# EAGLE design z80_small (EAGLE 6.5.0)
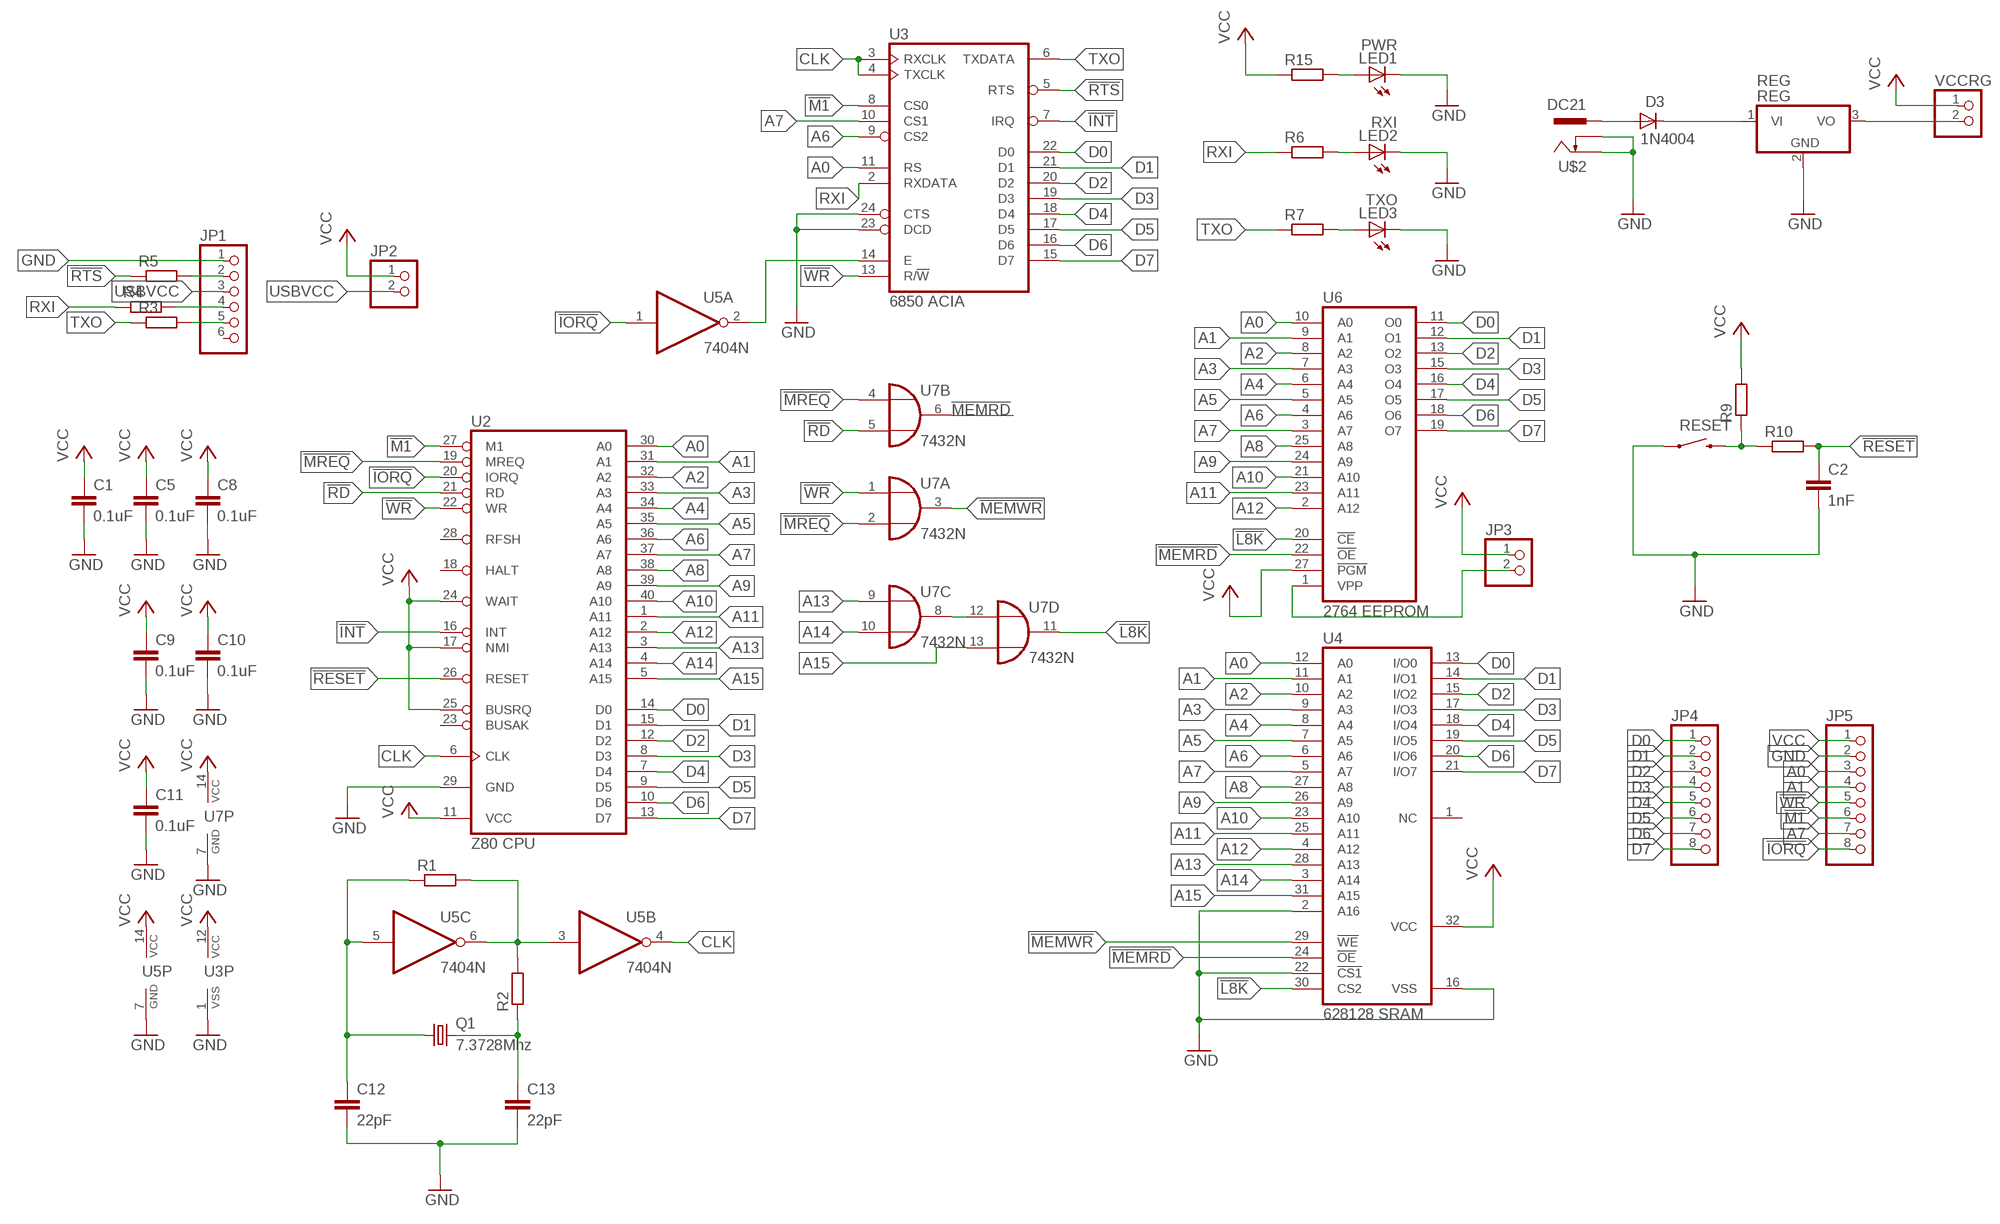
[diagram p0: schematic, sheet 1]

## Parts
C1  0.1uF  C-EU025-025X050  [C025-025X050]
C2  1nF  C-EU025-025X050  [C025-025X050]
C5  0.1uF  C-EU025-025X050  [C025-025X050]
C8  0.1uF  C-EU025-025X050  [C025-025X050]
C9  0.1uF  C-EU025-025X050  [C025-025X050]
C10  0.1uF  C-EU025-025X050  [C025-025X050]
C11  0.1uF  C-EU025-025X050  [C025-025X050]
C12  22pF  C-EU025-025X050  [C025-025X050]
C13  22pF  C-EU025-025X050  [C025-025X050]
D3  1N4004  [DO41-10]
JP1  PINHD-1X6  [1X06]
JP2  PINHD-1X2  [1X02]
JP3  PINHD-1X2  [1X02]
JP4  PINHD-1X8  [1X08]
JP5  PINHD-1X8  [1X08]
LED1  PWR  LED3MM  [LED3MM]
LED2  RXI  LED3MM  [LED3MM]
LED3  TXO  LED3MM  [LED3MM]
Q1  7.3728Mhz  CRYSTALHC49S  [HC49/S]
R1  1M  R-EU_0204/7  [0204/7]
R2  1K  R-EU_0204/7  [0204/7]
R3  2K2  R-EU_0204/7  [0204/7]
R4  2K2  R-EU_0204/7  [0204/7]
R5  2K2  R-EU_0204/7  [0204/7]
R6  470  R-EU_0204/7  [0204/7]
R7  470  R-EU_0204/7  [0204/7]
R9  10K  R-EU_0204/7  [0204/7]
R10  330  R-EU_0204/7  [0204/7]
R15  470  R-EU_0204/7  [0204/7]
REG  REG  786TV  [TO220V]
RESET  SWITCH-MOMENTARY-2SIDE_EZ  [TACTILE-PTH-SIDEEZ]
U2  Z80 CPU  Z80CPU  [DIL40]
U3  6850 ACIA  6850  [DIL24]
U4  628128 SRAM  628128P  [DIL32]
U5  7404N  [DIL14]
U6  2764 EEPROM  2764  [DIL28]
U7  7432N  [DIL14]
U$2  DC21  [DCSKT]
VCCRG  PINHD-1X2  [1X02]

## Nets
!INT: U2.16(INT) U3.7(IRQ)
!IORQ: JP5.8 U2.20(IORQ) U5.1(A:I)
!L8K: U4.30(CS2) U6.20(!CE) U7.11(D:O)
!M1: JP5.6 U2.27(M1) U3.8(CS0)
!MEMRD: U4.24(!OE) U6.22(!OE) U7.6(B:O)
!MEMWR: U4.29(!WE) U7.3(A:O)
!MREQ: U2.19(MREQ) U7.2(A:I1) U7.4(B:I0)
!PRTS: JP1.2 R5.2
!RD: U2.21(RD) U7.5(B:I1)
!RESET: C2.1 R10.2 U2.26(RESET)
!RTS: R5.1 U3.5(RTS)
!WR: JP5.5 U2.22(WR) U3.13(R/!W) U7.1(A:I0)
+VRAW [VCC]: D3.C REG.1(VI)
A0: JP5.3 U2.30(A0) U3.11(RS) U4.12(A0) U6.10(A0)
A1: JP5.4 U2.31(A1) U4.11(A1) U6.9(A1)
A2: U2.32(A2) U4.10(A2) U6.8(A2)
A3: U2.33(A3) U4.9(A3) U6.7(A3)
A4: U2.34(A4) U4.8(A4) U6.6(A4)
A5: U2.35(A5) U4.7(A5) U6.5(A5)
A6: U2.36(A6) U3.9(CS2) U4.6(A6) U6.4(A6)
A7: JP5.7 U2.37(A7) U3.10(CS1) U4.5(A7) U6.3(A7)
A8: U2.38(A8) U4.27(A8) U6.25(A8)
A9: U2.39(A9) U4.26(A9) U6.24(A9)
A10: U2.40(A10) U4.23(A10) U6.21(A10)
A11: U2.1(A11) U4.25(A11) U6.23(A11)
A12: U2.2(A12) U4.4(A12) U6.2(A12)
A13: U2.3(A13) U4.28(A13) U7.9(C:I0)
A14: U2.4(A14) U4.3(A14) U7.10(C:I1)
A15: U2.5(A15) U4.31(A15) U7.13(D:I1)
CLK: U2.6(CLK) U3.3(RXCLK) U3.4(TXCLK) U5.4(B:O)
D0: JP4.1 U2.14(D0) U3.22(D0) U4.13(I/O0) U6.11(O0)
D1: JP4.2 U2.15(D1) U3.21(D1) U4.14(I/O1) U6.12(O1)
D2: JP4.3 U2.12(D2) U3.20(D2) U4.15(I/O2) U6.13(O2)
D3: JP4.4 U2.8(D3) U3.19(D3) U4.17(I/O3) U6.15(O3)
D4: JP4.5 U2.7(D4) U3.18(D4) U4.18(I/O4) U6.16(O4)
D5: JP4.6 U2.9(D5) U3.17(D5) U4.19(I/O5) U6.17(O5)
D6: JP4.7 U2.10(D6) U3.16(D6) U4.20(I/O6) U6.18(O6)
D7: JP4.8 U2.13(D7) U3.15(D7) U4.21(I/O7) U6.19(O7)
GND [GND]: C1.2 C2.2 C5.2 C8.2 C9.2 C10.2 C11.2 C12.2 C13.2 JP1.1 JP5.2 LED1.K(C) LED2.K(C) LED3.K(C) RESET.1 U2.29(GND) U3.1(VSS) U3.23(DCD) U3.24(CTS) U4.2(A16) U4.16(VSS) U4.22(!CS1) U5.7(P:GND) U7.7(P:GND) U$2.2 U$2.3
N$1: R1.2 R2.2 U5.3(B:I) U5.6(C:O)
N$2: U3.14(E) U5.2(A:O)
N$3: C12.1 Q1.1 R1.1 U5.5(C:I)
N$4: U7.8(C:O) U7.12(D:I0)
N$5: C13.1 Q1.2 R2.1
N$6: REG.3(VO) VCCRG.2
N$7: LED2.A R6.2
N$8: LED3.A R7.2
N$12 [VCC]: D3.A U$2.1
N$14: R9.1 R10.1 RESET.2
N$17: LED1.A R15.2
PRXI: JP1.4 R4.2
PTXO: JP1.5 R3.2
RXI: R4.1 R6.1 U3.2(RXDATA)
TXO: R3.1 R7.1 U3.6(TXDATA)
USBVCC [VCC]: JP1.3 JP2.2
VCC [VCC]: C1.1 C5.1 C8.1 C9.1 C10.1 C11.1 JP2.1 JP3.1 JP5.1 R9.2 R15.1 U2.11(VCC) U2.17(NMI) U2.24(WAIT) U2.25(BUSRQ) U3.12(VCC) U4.32(VCC) U5.14(P:VCC) U6.27(!PGM) U7.14(P:VCC) VCCRG.1
VPP [VCC]: JP3.2 U6.1(VPP)
Unconnected: JP1.6 REG.2(GND) U2.18(HALT) U2.23(BUSAK) U2.28(RFSH) U4.1(NC) U5.8(D:O) U5.9(D:I) U5.10(E:O) U5.11(E:I) U5.12(F:O) U5.13(F:I)

## Power pins joined to a net without a drawn wire
GND: U6.14(GND)
VCC: U6.28(VCC)

## Library data of the parts
C1 C2 C5 C8-C13 = rcl:C-EU: CAPACITOR, European symbol
D3 = diode:1N4004: DIODE general purpose rectifier, 1 A
JP1 = pinhead:PINHD-1X6: PIN HEADER
JP2 JP3 VCCRG = pinhead:PINHD-1X2: PIN HEADER
JP4 JP5 = pinhead:PINHD-1X8: PIN HEADER
LED1-LED3 = led:LED: LED OSRAM: - CHIPLED LG R971, LG N971, LY N971, LG Q971, LY Q971, LO R971, LY R971 LH N974, LH R974 LS Q976, LO Q976, LY Q976 LO Q996 - Hyper CHIPLED LW Q18S LB Q993, LB Q99A, LB R99A - SideLED LS A670, LO A670, LY A670, LG A670, LP A670 LB A673, LV A673, LT A673, LW A673 LH A674 LY A675 LS A676, LA A676, LO A676, LY A676, LW A676 LS A679, LY A679, LG A679 - Hyper Micro SIDELED® LS Y876, LA Y876, LO Y876, LY Y876 LT Y87S - SmartLED LW L88C, LW L88S LB L89C, LB L89S, LG L890 LS L89K, LO L89K, LY L89K LS L896, LA L896, LO L896, LY L896 - TOPLED LS T670, LO T670, LY T670, LG T670, LP T670 LSG T670, LSP T670, LSY T670, LOP T670, LYG T670 LG T671, LOG T671, LSG T671 LB T673, LV T673, LT T673, LW T673 LH T674 LS T676, LA T676, LO T676, LY T676, LB T676, LH T676, LSB T676, LW T676 LB T67C, LV T67C, LT T67C, LS T67K, LO T67K, LY T67K, LW E67C LS E67B, LA E67B, LO E67B, LY E67B, LB E67C, LV E67C, LT E67C LW T67C LS T679, LY T679, LG T679 LS T770, LO T770, LY T770, LG T770, LP T770 LB T773, LV T773, LT T773, LW T773 LH T774 LS E675, LA E675, LY E675, LS T675 LS T776, LA T776, LO T776, LY T776, LB T776 LHGB T686 LT T68C, LB T68C - Hyper Mini TOPLED® LB M676 - Mini TOPLED Santana® LG M470 LS M47K, LO M47K, LY M47K Source: http://www.osram.convergy.de LUXEON: - LUMILED® LXK2-PW12-R00, LXK2-PW12-S00, LXK2-PW14-U00, LXK2-PW14-V00 LXK2-PM12-R00, LXK2-PM12-S00, LXK2-PM14-U00 LXK2-PE12-Q00, LXK2-PE12-R00, LXK2-PE12-S00, LXK2-PE14-T00, LXK2-PE14-U00 LXK2-PB12-K00, LXK2-PB12-L00, LXK2-PB12-M00, LXK2-PB14-N00, LXK2-PB14-P00, LXK2-PB14-Q00 LXK2-PR12-L00, LXK2-PR12-M00, LXK2-PR14-Q00, LXK2-PR14-R00 LXK2-PD12-Q00, LXK2-PD12-R00, LXK2-PD12-S00 LXK2-PH12-R00, LXK2-PH12-S00 LXK2-PL12-P00, LXK2-PL12-Q00, LXK2-PL12-R00 Source: www.luxeon.com KINGBRIGHT: KA-3528ASYC Source: www.kingbright.com
Q1 = crystal:CRYSTAL: CRYSTAL; OC_FARNELL: 1667008; OC_NEWARK: unknown
R1-R7 R9 R10 R15 = rcl:R-EU_: RESISTOR, European symbol
REG = linear:78*: Positive VOLTAGE REGULATOR Source: http://cache.national.com/ds/LM/LM78L05.pdf http://www.fairchildsemi.com/ds/LM/LM7805.pdf
RESET = SparkFun-Electromechanical:SWITCH-MOMENTARY-2: Various NO switches- pushbuttons, reed, etc
U2 = zilog:Z80CPU: Z80 FAMILY DEVICE
U3 = micro-motorola:6850: MICROCONTROLLER/MEMORY DEVICE; MF: NTE ELECTRONICS; MPN: NTE6850; OC_FARNELL: 4899775; OC_NEWARK: 31C2457
U4 = memory-hitachi:628128P: MEMORY; OC_FARNELL: unknown; OC_NEWARK: unknown
U5 = 74xx-eu:74*04: Hex INVERTER
U6 = memory:2764: MEMORY
U7 = 74xx-eu:74*32: Quad 2-input OR gate
U$2 = dcsocket:DC21: DC 2.1 mm Power Socket Negative Centre

## Net classes
0 default: width 0.254 mm, drill 0.508 mm
1 VCC: width 0.66 mm, drill 0.508 mm
2 GND: width 0.66 mm, drill 0.508 mm

## Board
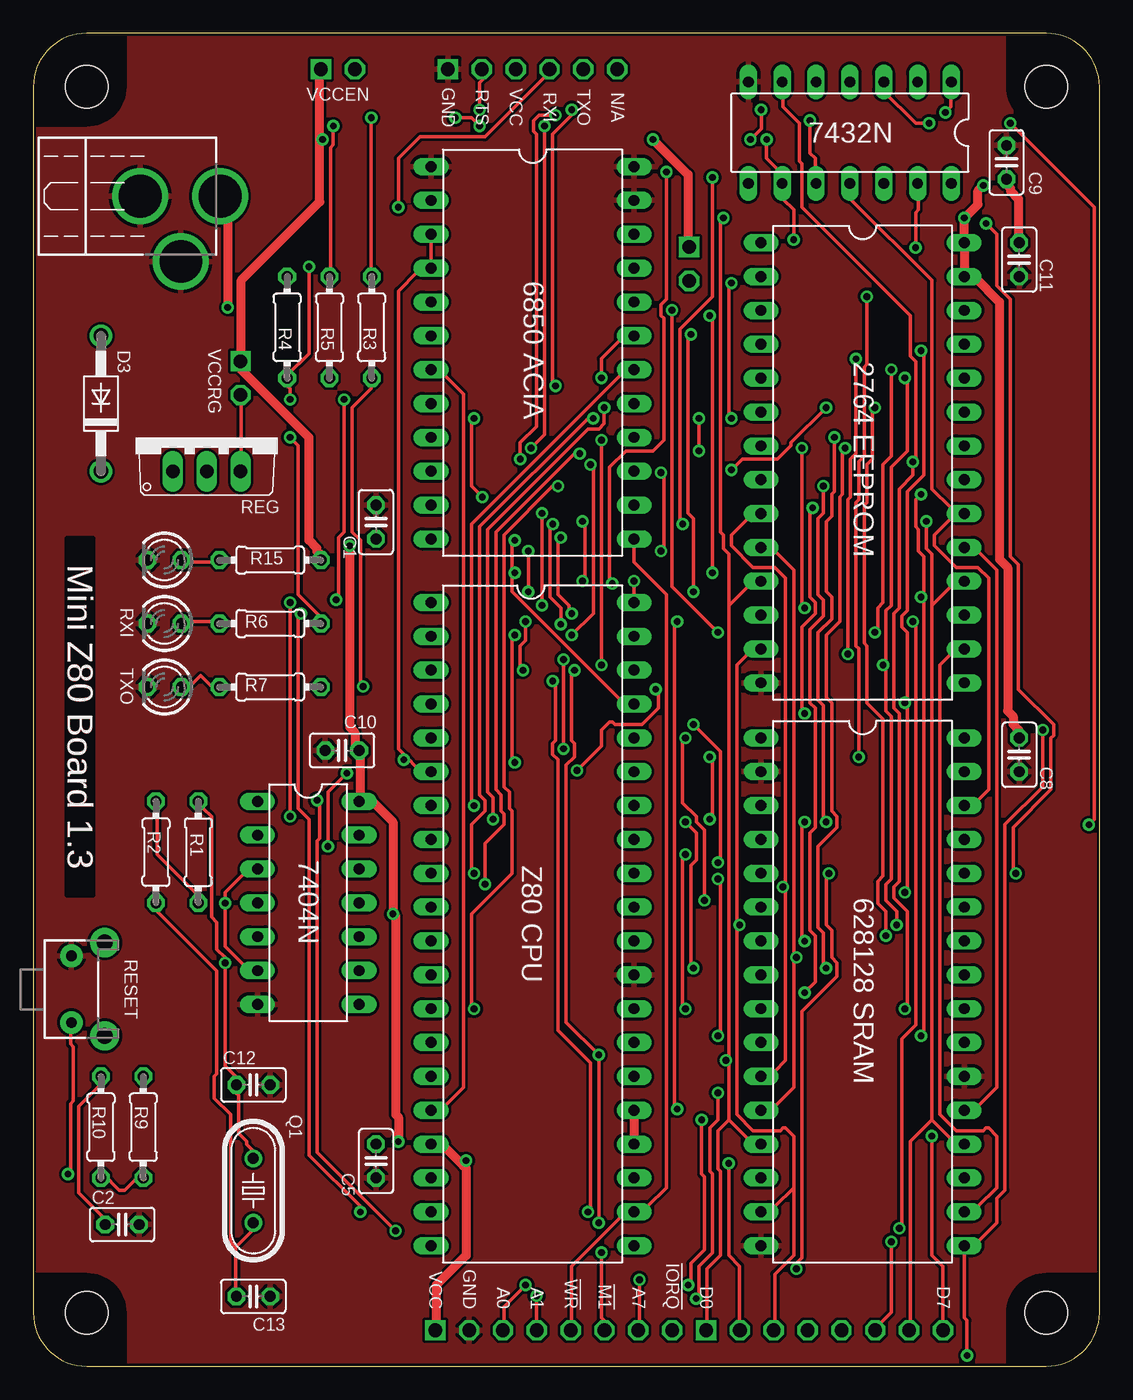
[diagram p1: board, top side]
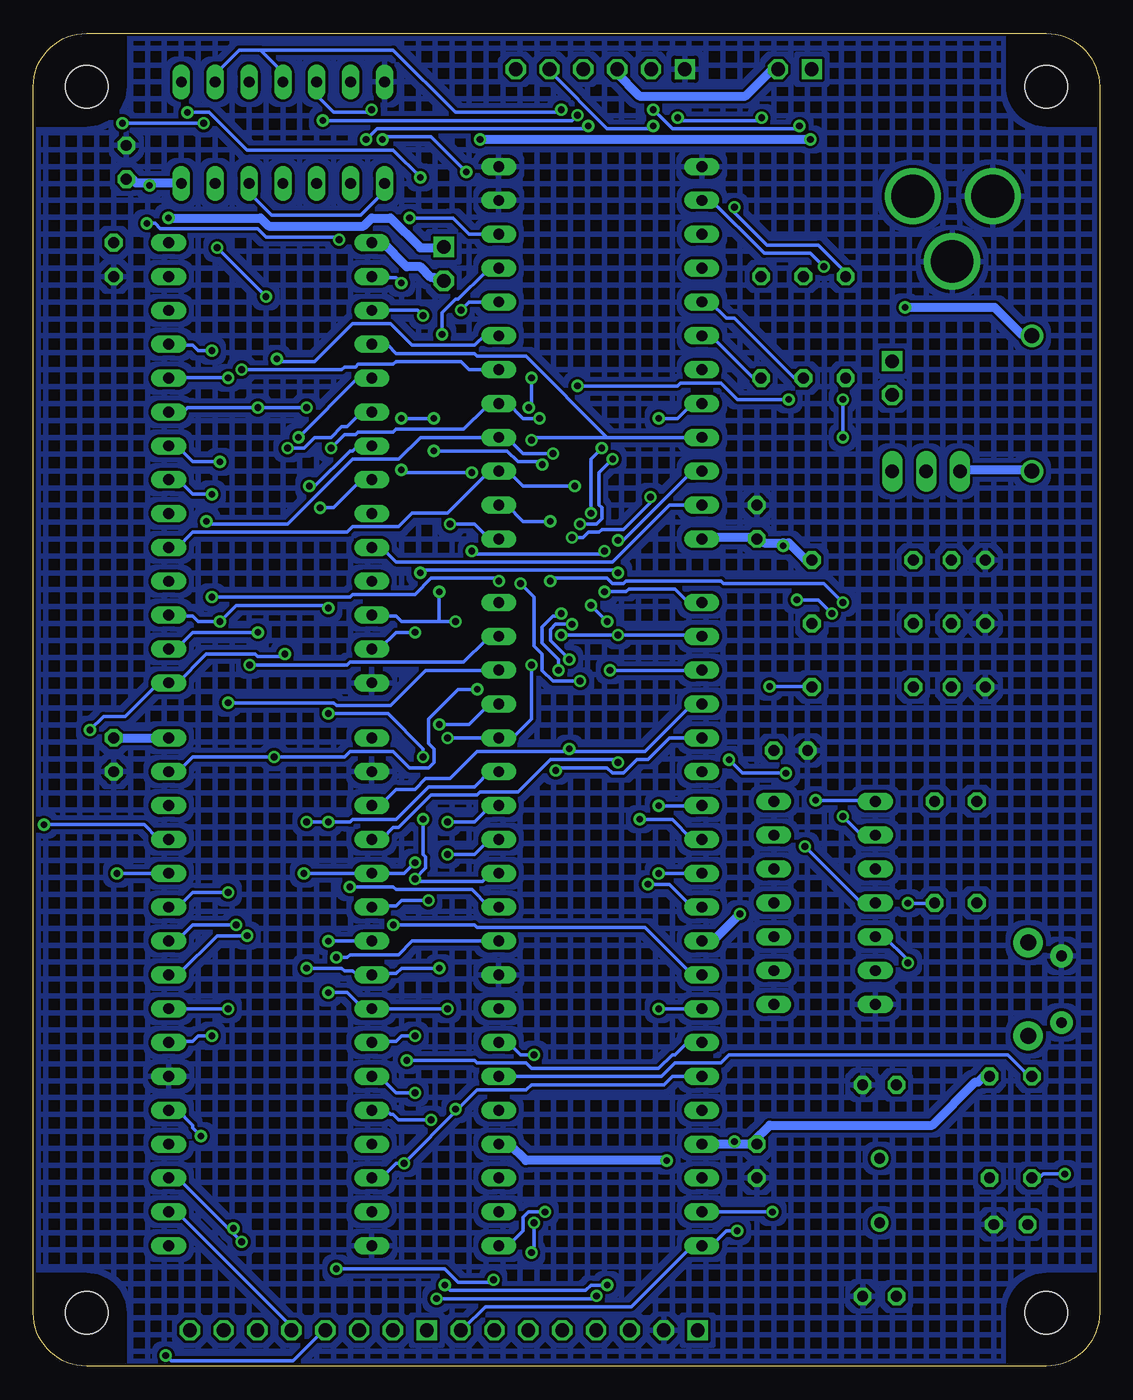
[diagram p2: board, bottom side, seen from below]

Size 80 x 100 mm. Coordinates in mm from the lower left corner, seen from the top.
Copper layers (1*16): Top 0.035mm / dielectric 1.5mm / Bottom 0.035mm
Design rules "default *": minimum track width 10mil, minimum drill 20mil, track to track 8mil, track to pad 8mil, pad to pad 8mil, via to via 8mil, smd to smd 8mil, copper to edge 8mil, drill to drill 8mil, minimum pad ring 10mil, minimum via ring 8mil, stop-mask expansion 4mil, vias tented up to drill 0mil, thermal gap 10mil

### Footprints (pad centres in the part's own frame; a part is rotated, then mirrored left to right if it is on the bottom)
C025-025X050 = drill 0.813 octagon: 1 -1.27,0; 2 1.27,0
DO41-10 = drill 1.118: A 5.08,0; C -5.08,0
1X06 = drill 1.016 square: 1 -6.35,0 | drill 1.016 octagon: 2 -3.81,0; 3 -1.27,0; 4 1.27,0; 5 3.81,0; 6 6.35,0
1X02 = drill 1.016 square: 1 -1.27,0 | drill 1.016 octagon: 2 1.27,0
1X08 = drill 1.016 square: 1 -8.89,0 | drill 1.016 octagon: 2 -6.35,0; 3 -3.81,0; 4 -1.27,0; 5 1.27,0; 6 3.81,0; 7 6.35,0; 8 8.89,0
LED3MM = drill 0.813 octagon: A -1.27,0; K 1.27,0
HC49/S = drill 0.813: 1 -2.413,0; 2 2.413,0
0204/7 = drill 0.813 octagon: 1 -3.81,0; 2 3.81,0
TO220V = drill 1.016 long: 1 -2.54,-2.54; 2 0,-2.54; 3 2.54,-2.54
TACTILE-PTH-SIDEEZ = drill 0.8 pad 1.7: 1 -2.5,0; 2 2.5,0 | drill 1.2 pad 2.2: ANCHOR1 -3.5,2.5; ANCHOR2 3.5,2.5
DIL40 = drill 0.813 long: 1 -24.13,-7.62; 2 -21.59,-7.62; 3 -19.05,-7.62; 4 -16.51,-7.62; 5 -13.97,-7.62; 6 -11.43,-7.62; 7 -8.89,-7.62; 8 -6.35,-7.62; 9 -3.81,-7.62; 10 -1.27,-7.62; 11 1.27,-7.62; 12 3.81,-7.62; 13 6.35,-7.62; 14 8.89,-7.62; 15 11.43,-7.62; 16 13.97,-7.62; 17 16.51,-7.62; 18 19.05,-7.62; 19 21.59,-7.62; 20 24.13,-7.62; 21 24.13,7.62; 22 21.59,7.62; 23 19.05,7.62; 24 16.51,7.62; 25 13.97,7.62; 26 11.43,7.62; 27 8.89,7.62; 28 6.35,7.62; 29 3.81,7.62; 30 1.27,7.62; 31 -1.27,7.62; 32 -3.81,7.62; 33 -6.35,7.62; 34 -8.89,7.62; 35 -11.43,7.62; 36 -13.97,7.62; 37 -16.51,7.62; 38 -19.05,7.62; 39 -21.59,7.62; 40 -24.13,7.62
DIL24 = drill 0.813 long: 1 -13.97,-7.62; 2 -11.43,-7.62; 3 -8.89,-7.62; 4 -6.35,-7.62; 5 -3.81,-7.62; 6 -1.27,-7.62; 7 1.27,-7.62; 8 3.81,-7.62; 9 6.35,-7.62; 10 8.89,-7.62; 11 11.43,-7.62; 12 13.97,-7.62; 13 13.97,7.62; 14 11.43,7.62; 15 8.89,7.62; 16 6.35,7.62; 17 3.81,7.62; 18 1.27,7.62; 19 -1.27,7.62; 20 -3.81,7.62; 21 -6.35,7.62; 22 -8.89,7.62; 23 -11.43,7.62; 24 -13.97,7.62
DIL32 = drill 0.813 long: 1 -19.05,-7.62; 2 -16.51,-7.62; 3 -13.97,-7.62; 4 -11.43,-7.62; 5 -8.89,-7.62; 6 -6.35,-7.62; 7 -3.81,-7.62; 8 -1.27,-7.62; 9 1.27,-7.62; 10 3.81,-7.62; 11 6.35,-7.62; 12 8.89,-7.62; 13 11.43,-7.62; 14 13.97,-7.62; 15 16.51,-7.62; 16 19.05,-7.62; 17 19.05,7.62; 18 16.51,7.62; 19 13.97,7.62; 20 11.43,7.62; 21 8.89,7.62; 22 6.35,7.62; 23 3.81,7.62; 24 1.27,7.62; 25 -1.27,7.62; 26 -3.81,7.62; 27 -6.35,7.62; 28 -8.89,7.62; 29 -11.43,7.62; 30 -13.97,7.62; 31 -16.51,7.62; 32 -19.05,7.62
DIL14 = drill 0.813 long: 1 -7.62,-3.81; 2 -5.08,-3.81; 3 -2.54,-3.81; 4 0,-3.81; 5 2.54,-3.81; 6 5.08,-3.81; 7 7.62,-3.81; 8 7.62,3.81; 9 5.08,3.81; 10 2.54,3.81; 11 0,3.81; 12 -2.54,3.81; 13 -5.08,3.81; 14 -7.62,3.81
DIL28 = drill 0.813 long: 1 -16.51,-7.62; 2 -13.97,-7.62; 3 -11.43,-7.62; 4 -8.89,-7.62; 5 -6.35,-7.62; 6 -3.81,-7.62; 7 -1.27,-7.62; 8 1.27,-7.62; 9 3.81,-7.62; 10 6.35,-7.62; 11 8.89,-7.62; 12 11.43,-7.62; 13 13.97,-7.62; 14 16.51,-7.62; 15 16.51,7.62; 16 13.97,7.62; 17 11.43,7.62; 18 8.89,7.62; 19 6.35,7.62; 20 3.81,7.62; 21 1.27,7.62; 22 -1.27,7.62; 23 -3.81,7.62; 24 -6.35,7.62; 25 -8.89,7.62; 26 -11.43,7.62; 27 -13.97,7.62; 28 -16.51,7.62
DP10080_V1 = hole 3.2: -46,-36; 46,-36; 46,36; -46,36
DCSKT = drill 3.2: 1 0,6.08; 2 0,0.08; 3 4.9,3.13

### Placement (x,y rotation side)
C1  25.71,63.33 90 top
C2  6.66,10.63 0 top
C5  25.71,15.39 270 top
C8  73.97,45.87 270 top
C9  73.02,90.32 90 top
C10  23.17,46.19 180 top
C11  73.97,83.02 270 top
C12  16.51,21.11 0 top
C13  16.51,5.23 0 top
D3  5.08,72.22 90 top
JP1  37.46,97.31 0 top
JP2  22.86,97.31 0 top
JP3  49.21,82.7 270 top
JP4  59.37,2.69 0 top
JP5  39.05,2.69 0 top
LED1  9.84,60.48 180 top
LED2  9.84,55.71 180 top
LED3  9.84,50.95 180 top
Q1  16.51,13.17 270 top
R1  12.38,38.57 270 top
R2  9.2,38.57 90 top
R3  25.4,77.94 90 top
R4  19.05,77.94 90 top
R5  22.22,77.94 90 top
R6  17.78,55.71 180 top
R7  17.78,50.95 180 top
R9  8.25,17.93 90 top
R10  5.08,17.93 90 top
R15  17.78,60.48 180 top
REG  13.01,69.69 0 top
RESET  2.85,28.28 270 top
U2  37.46,33.17 270 top
U3  37.46,76.03 270 top
U4  62.23,28.09 270 top
U5  20.63,34.76 270 top
U6  62.23,67.78 270 top
U7  61.27,92.55 180 top
U$1  SMZ80  [DP10080_V1]  40,50 90 top
U$2  7.93,87.78 270 top
VCCRG  15.55,74.13 270 top

### Tracks (layer width: path | path; a pad name or v marks a point on that pad's centre or on a via)
!INT
  Top 0.254: U3.7 30.03,74.77 30.44,74.36 30.84,74.36 32.27,72.94 32.27,20.92 30.84,19.49 29.83,19.49 29.83,19.29 U2.16
!IORQ  (via drill 0.51)
  Top 0.254: v21.29,42.46 21.5,42.25 21.5,39.61 21.29,39.41 21.29,16.04 v27.19,10.15
  Bottom 0.254: JP5.8 47.91,2.63 47.71,2.63 47.71,2.83 46.08,4.46 35.11,4.46 30.84,8.72 30.23,8.72 30.03,8.93 U2.20 29.83,9.13 29.01,9.13 28,10.15 v27.19,10.15 | v21.29,42.46 16.82,42.46 U5.1
!L8K
  Top 0.254: 68.84,63.79 69.65,63.79 U6.20 68.84,63.79 | 68.84,63.79 68.84,63.59 67.62,62.37 67.62,61.56 69.25,59.93 70.87,59.93 71.69,59.12 71.69,43.27 70.87,42.46 69.86,42.46 69.86,42.25 U4.30 | 68.84,63.79 68.84,64.4 67.42,65.82 67.42,81.47 61.32,87.57 61.32,88.58 U7.11
!M1  (via drill 0.51)
  Top 0.254: v42.43,10.76 v42.43,23.35 39.99,25.79 39.99,45.1 40.6,45.71 40.6,46.72 40.39,46.93 40.39,52.01 v40.6,52.21 | v42.63,8.52 42.63,3.64 42.83,3.44 42.83,2.83 JP5.6 | v33.08,71.11 32.88,70.9 32.88,66.03 v33.69,65.22 | v39.58,62.17 39.38,61.96 39.38,57.9 40.19,57.09 40.19,56.68 v40.39,56.48
  Bottom 0.254: v42.43,23.35 43.44,23.35 44.46,24.37 45.07,24.37 U2.27 | v42.43,10.76 42.43,8.72 v42.63,8.52 | v33.08,71.11 31.66,71.11 30.84,71.92 30.23,71.92 30.03,72.12 U3.8 | v33.69,65.22 33.69,64.81 35.72,62.78 37.35,62.78 37.55,62.57 38.36,62.57 38.77,62.17 v39.58,62.17 | v40.39,56.48 40.6,56.27 41,56.27 41.82,55.46 41.82,54.24 40.6,53.02 v40.6,52.21
!MEMRD  (via drill 0.51)
  Top 0.254: v65.39,26.81 65.59,27.01 65.59,34.12 64.57,35.14 64.57,35.95 64.98,36.36 64.98,48.96 64.57,49.36 64.57,56.48 64.98,56.88 64.98,65.82 66,66.84 v66,67.86 66.2,68.06 66.2,75.38 65.79,75.78 65.79,78.83 57.67,86.96 57.67,90.21 57.46,90.41 57.46,93.26 56.24,94.47 56.24,96.3 U7.6
  Bottom 0.254: v65.39,26.81 69.65,26.81 U4.24 | v66,67.86 68.03,67.86 69.25,69.08 69.65,69.08 U6.22
!MEMWR  (via drill 0.51)
  Top 0.254: v79.2,40.63 79.61,41.03 79.61,86.96 v73.31,93.26 | v67.22,93.26 66.2,93.26 63.76,95.69 63.76,96.3 U7.3
  Bottom 0.254: v79.2,40.63 71.69,40.63 70.67,39.61 69.86,39.61 U4.29 | v67.22,93.26 v73.31,93.26
!MREQ  (via drill 0.51)
  Top 0.254: v24.54,11.57 24.54,11.98 20.68,15.84 20.68,41.03 19.87,41.85 19.87,56.27 v20.07,56.48 | v22.72,57.49 22.92,57.7 22.92,62.17 23.32,62.57 v23.32,72.53 | v39.17,73.55 38.97,73.75 38.97,92.44 40.39,93.87 v40.39,94.27
  Bottom 0.254: 62.95,98.74 64.57,98.74 66,97.32 66.2,97.32 66.2,96.51 U7.2 | 62.95,98.74 61.53,97.32 61.53,96.3 61.32,96.3 U7.4 | v24.54,11.57 29.83,11.57 U2.19 | v20.07,56.48 21.09,57.49 v22.72,57.49 | v23.32,72.53 27.19,72.53 28.4,73.75 31.45,73.75 31.66,73.55 v39.17,73.55 | v40.39,94.27 40.6,94.07 48.32,94.07 52.99,98.74 62.95,98.74
!PRTS  (via drill 0.51)
  Top 0.254: v22.51,93.05 22.51,91.63 22.31,91.43 22.31,81.88 R5.2 | v33.48,94.27 33.48,96.3 33.69,96.51 33.69,97.12 JP1.2
  Bottom 0.254: v22.51,93.05 22.72,92.85 32.06,92.85 v33.48,94.27
!RD  (via drill 0.51)
  Top 0.254: v41.61,11.57 41.82,11.77 41.82,22.75 39.38,25.18 39.38,45.5 38.97,45.91 38.97,46.72 39.17,46.93 39.17,51.19 v38.97,51.4 | v43.44,58.71 43.24,58.91 43.24,67.45 44.46,68.67 46.49,68.67 47.3,69.48 47.3,78.63 47.1,78.83 47.1,79.64 47.51,80.05 v47.51,89.6 | v53.8,92.04 54.62,92.85 v54.62,94.27
  Bottom 0.254: v41.61,11.57 42.83,11.57 43.24,11.16 43.24,10.15 44.25,9.13 45.07,9.13 U2.21 | v38.97,51.4 41,51.4 41.82,52.21 41.82,53.43 42.43,54.04 42.43,57.7 v43.44,58.71 | v47.51,89.6 50.15,92.24 53.6,92.24 v53.8,92.04 | v54.62,94.27 54.82,94.07 57.46,94.07 58.48,95.08 58.48,96.3 58.68,96.3 U7.5
!RESET
  Top 0.254: C2.1 5.24,10.76 5.24,11.16 3.41,12.99 3.41,19.49 5.24,21.32 5.24,21.73 R10.2
  Bottom 0.254: U2.26 45.07,21.73 32.88,21.73 31.86,22.75 28.4,22.75 27.8,23.35 6.87,23.35 5.44,21.93 5.44,21.73 5.24,21.73 R10.2
!RTS
  Bottom 0.254: U3.5 29.22,79.84 28,78.63 27.39,78.63 22.92,74.16 22.31,74.16 R5.1
!WR  (via drill 0.51)
  Top 0.254: U3.13 45.07,61.96 45.07,60.34 47.51,57.9 47.51,13.4 46.08,11.98 45.07,11.98 45.07,11.77 U2.22 45.07,11.57 45.07,11.16 44.05,11.16 40.39,7.51 40.39,2.83 JP5.5 | v68.44,94.07 68.84,94.47 68.84,96.3 U7.1 | v50.96,89.19 50.96,80.25 48.52,77.81 48.52,63.39 v48.72,63.18
  Bottom 0.254: v68.44,94.07 66.81,94.07 63.96,91.22 52.99,91.22 v50.96,89.19 | v48.72,63.18 46.9,63.18 45.88,62.17 45.27,62.17 U3.13
+VRAW
  Bottom 0.66: REG.1 10.32,67.25 5.24,67.25 D3.C
A0  (via drill 0.51)
  Top 0.254: 57.06,30.67 57.06,20.92 55.63,19.49 54.62,19.49 54.62,19.29 U4.12 | 57.06,30.67 57.06,59.73 55.63,61.15 55.63,61.35 54.62,61.35 U6.10 | 57.06,30.67 v57.26,30.67 | v36.94,6.08 35.31,4.46 35.31,2.83 JP5.3 | v49.13,6.08 49.33,6.29 49.33,7.71 50.35,8.72 50.35,14.21 50.15,14.41 v50.15,18.48
  Bottom 0.254: v57.26,30.67 56.45,30.67 56.24,30.87 52.59,30.87 51.57,31.89 45.27,31.89 U2.30 | U3.11 32.27,64.61 36.53,60.34 52.79,60.34 53.8,61.35 54.41,61.35 U6.10 | v36.94,6.08 38.16,6.08 38.56,5.68 48.72,5.68 v49.13,6.08 | v50.15,18.48 52.59,18.48 52.99,18.88 53.2,18.88 53.6,19.29 54.41,19.29 U4.12
A1  (via drill 0.51)
  Top 0.254: 56.45,35.95 56.45,22.95 55.63,22.14 54.62,22.14 54.62,21.93 U4.11 | 56.45,35.95 56.45,59.12 55.63,59.93 54.01,59.93 52.38,61.56 52.38,62.37 53.6,63.59 53.6,63.79 54.41,63.79 U6.9 | 56.45,35.95 v56.24,35.95 | v37.75,5.27 37.75,2.83 JP5.4 | v49.74,5.07 49.94,5.27 49.94,7.51 50.96,8.52 50.96,14.41 50.76,14.62 50.76,17.87 51.37,18.48 v51.37,20.51
  Bottom 0.254: v56.24,35.95 52.99,35.95 52.79,35.75 47.1,35.75 45.88,34.53 45.27,34.53 U2.31 | v37.75,5.27 37.96,5.07 v49.74,5.07 | v51.37,20.51 52.79,20.51 54.01,21.73 54.41,21.73 U4.11
A2  (via drill 0.51)
  Top 0.254: v51.37,24.78 51.57,24.98 51.57,36.36 v51.37,36.56 | v58.48,64.4 58.28,64.2 58.28,57.7 58.68,57.29 58.68,56.48 57.67,55.46 57.67,49.16 v57.87,48.96 | v50.76,45.71 50.96,45.5 50.96,41.24 v50.76,41.03
  Bottom 0.254: v51.37,24.78 52.38,24.78 52.79,24.37 54.41,24.37 U4.10 | U2.32 45.27,36.97 45.68,36.97 46.29,36.36 51.16,36.36 v51.37,36.56 50.55,37.38 50.55,38.19 50.76,38.39 v50.76,41.03 | v58.48,64.4 57.46,64.4 55.43,66.43 54.62,66.43 U6.8 | v57.87,48.96 53.4,48.96 50.76,46.32 v50.76,45.71
A3  (via drill 0.51)
  Top 0.254: v48.93,26.81 48.72,27.01 48.72,38.19 v48.93,38.39 | v59.29,66.03 59.29,64 58.88,63.59 58.88,57.9 59.29,57.49 59.29,56.27 58.28,55.26 58.28,49.77 58.68,49.36 58.68,40.42 58.28,40.02 58.28,32.7 58.68,32.3 58.68,28.84 v57.87,28.03
  Bottom 0.254: v48.93,26.81 54.41,26.81 U4.9 54.62,26.81 55.23,26.81 56.45,28.03 v57.87,28.03 | v48.93,38.39 46.9,38.39 45.68,39.61 45.27,39.61 U2.33 | v59.29,66.03 58.88,66.03 56.24,68.67 56.04,68.67 55.63,69.08 54.62,69.08 U6.7
A4  (via drill 0.51)
  Top 0.254: v49.54,29.86 49.33,30.06 49.33,37.58 49.74,37.99 49.74,40.02 v48.93,40.83 | v60.92,68.87 60.71,68.67 60.71,65.42 60.51,65.22 60.51,55.87 59.49,54.85 59.49,50.18 59.9,49.77 59.9,41.64 60.31,41.24 60.31,40.42 58.88,39 58.88,32.91 59.29,32.5 59.29,30.06 v59.49,29.86
  Bottom 0.254: v49.54,29.86 52.38,29.86 52.79,29.45 54.41,29.45 U4.8 54.62,29.45 55.84,29.45 56.04,29.65 56.65,29.65 56.85,29.86 v59.49,29.86 | v48.93,40.83 46.9,40.83 45.68,42.05 45.27,42.05 U2.34 | v60.92,68.87 59.7,68.87 58.88,69.69 57.67,69.69 56.85,70.5 56.45,70.5 55.43,71.51 54.62,71.51 U6.6
A5  (via drill 0.51)
  Top 0.254: v57.87,31.89 57.67,32.09 57.67,40.63 v57.87,40.83 | v60.1,69.69 60.1,65.62 59.9,65.42 59.9,63.79 59.49,63.39 59.49,58.1 59.9,57.7 59.9,56.07 58.88,55.05 58.88,49.97 59.29,49.57 59.29,41.03 v59.49,40.83
  Bottom 0.254: v57.87,31.89 54.62,31.89 U4.7 | U2.35 45.27,44.69 45.68,44.69 46.9,43.47 50.35,43.47 52.79,41.03 56.04,41.03 56.24,40.83 v57.87,40.83 v59.49,40.83 | v60.1,69.69 55.63,74.16 54.62,74.16 U6.5
A6  (via drill 0.51)
  Top 0.254: v50.35,34.94 50.35,40.22 49.74,40.83 49.74,41.24 48.72,42.25 48.72,46.93 v48.93,47.13 | v42.63,69.48 v42.63,52.62
  Bottom 0.254: v50.35,34.94 52.38,34.94 52.79,34.53 54.41,34.53 U4.6 | v48.93,47.13 45.27,47.13 U2.36 45.07,47.13 44.05,47.13 42.63,48.55 v42.63,52.62 | 36.94,69.69 U3.9 | 36.94,69.69 43.04,75.78 46.69,75.78 46.9,75.98 52.79,75.98 53.4,76.59 54.41,76.59 U6.4 | v42.63,69.48 42.43,69.69 36.94,69.69
A7  (via drill 0.51)
  Top 0.254: v51.37,37.78 51.57,37.99 51.57,46.11 v49.54,48.15 | v36.13,61.96 35.92,61.76 35.92,59.52 | 35.92,59.52 35.92,58.1 44.05,49.97 45.07,49.97 45.07,49.77 U2.37 | v50.76,78.83 50.96,78.63 v50.96,59.52 | 35.92,59.52 v36.13,59.52 | v45.47,6.49 45.47,2.83 JP5.7 | v57.26,7.3 57.26,7.71 57.67,8.11 57.67,26.61 60.31,29.25 60.31,30.26 59.9,30.67 59.9,32.7 59.49,33.11 59.49,36.77 v59.7,36.97
  Bottom 0.254: v51.37,37.78 52.18,36.97 54.41,36.97 U4.5 54.62,36.97 v59.7,36.97 | v49.54,48.15 47.3,48.15 45.68,49.77 45.27,49.77 U2.37 | v36.13,61.96 35.72,61.96 30.84,66.84 30.23,66.84 30.03,67.04 U3.10 | v50.76,78.83 51.16,79.23 54.41,79.23 U6.3 | v50.96,59.52 50.76,59.73 36.33,59.73 v36.13,59.52 | v45.47,6.49 45.68,6.29 48.12,6.29 49.13,7.3 v57.26,7.3
A8  (via drill 0.51)
  Top 0.254: 65.59,49.57 65.59,35.75 v65.39,35.55 | v66.61,76.19 66.81,75.98 66.81,66.84 65.59,65.62 65.59,56.68 65.18,56.27 65.18,55.46 65.59,55.05 65.59,49.57 | 65.59,49.57 v65.39,49.77
  Bottom 0.254: v65.39,49.77 57.46,49.77 57.26,49.57 53.2,49.57 50.55,52.21 45.27,52.21 U2.38 | v65.39,35.55 68.03,35.55 69.04,34.53 69.65,34.53 U4.27 | v66.61,76.19 67.62,76.19 68.03,76.59 69.65,76.59 U6.25
A9  (via drill 0.51)
  Top 0.254: 63.96,52.41 63.96,49.16 64.37,48.75 64.37,36.56 63.96,36.16 63.96,34.94 64.78,34.12 v64.78,33.11 | v65.39,74.16 65.59,73.95 65.59,68.67 64.37,67.45 64.37,57.09 63.96,56.68 63.96,52.41 | 63.96,52.41 v63.76,52.62
  Bottom 0.254: v63.76,52.62 56.45,52.62 56.24,52.82 47.71,52.82 46.08,54.45 45.47,54.45 45.27,54.65 U2.39 | v64.78,33.11 68.03,33.11 69.25,31.89 69.65,31.89 U4.26 | v65.39,74.16 69.65,74.16 U6.24
A10  (via drill 0.51)
  Top 0.254: v66.61,24.78 66.81,24.98 66.81,57.7 | 66.81,57.7 66.81,60.74 66.4,61.15 66.4,62.78 66.2,62.98 66.2,65.01 v66.61,65.42 | v45.07,58.91 45.07,57.49 U2.40 | 66.81,57.7 v66.61,57.7
  Bottom 0.254: v66.61,24.78 67.62,24.78 68.03,24.37 69.65,24.37 U4.23 | v66.61,65.42 68.03,65.42 69.04,66.43 69.65,66.43 U6.21 | v45.07,58.91 45.27,59.12 50.15,59.12 51.37,57.9 56.04,57.9 56.24,57.7 v66.61,57.7
A11  (via drill 0.51)
  Top 0.254: v37.14,61.15 v37.14,58.1 | v47.1,61.15 47.3,61.35 47.3,66.84 v47.1,67.04 | v52.38,67.25 53.2,68.06 55.84,68.06 56.85,69.08 56.85,69.28 v59.49,71.92 | v63.96,32.3 63.96,34.12 63.36,34.73 63.36,36.36 63.76,36.77 63.76,48.55 62.54,49.77 62.54,54.04 62.34,54.24 62.34,64.61 62.54,64.81 62.54,67.65 62.95,68.06 62.95,71.72 v63.15,71.92
  Bottom 0.254: v37.14,58.1 35.52,58.1 35.31,58.31 31.86,58.31 30.84,57.29 30.03,57.29 U2.1 | v37.14,61.15 37.35,60.95 46.9,60.95 v47.1,61.15 | v47.1,67.04 52.18,67.04 v52.38,67.25 | v59.49,71.92 v63.15,71.92 68.44,71.92 68.84,71.51 69.65,71.51 U6.23 | v63.96,32.3 66.2,32.3 69.04,29.45 69.65,29.45 U4.25
A12  (via drill 0.51)
  Top 0.254: v36.13,54.85 35.92,54.65 35.92,45.5 v36.13,45.3 | v52.38,81.27 52.18,81.06 52.18,71.31 v52.38,71.11 | v49.94,68.67 v49.94,71.11 | v41.82,67.65 42.02,67.45 42.02,56.48 v40.39,54.85
  Bottom 0.254: v36.13,45.3 36.33,45.5 41.21,45.5 43.64,43.07 46.49,43.07 46.69,42.86 50.15,42.86 52.59,40.42 52.99,40.42 53.8,39.61 54.41,39.61 U4.4 | U2.2 30.03,54.85 v36.13,54.85 v40.39,54.85 | v52.38,81.27 52.79,81.67 54.41,81.67 U6.2 | v49.94,71.11 v52.38,71.11 | v49.94,68.67 44.46,68.67 43.64,67.86 42.02,67.86 v41.82,67.65
A13  (via drill 0.51)
  Top 0.254: v36.74,52.21 36.53,52.41 36.53,54.04 36.94,54.45 v36.94,55.87 | v38.16,64 v38.16,57.09 | v37.35,68.87 38.36,69.89 v38.36,93.05 | v55.02,92.04 55.02,90.61 56.24,89.39 56.24,88.79 U7.9 56.24,88.58 56.24,87.57 57.06,86.75 v57.06,84.52 | v73.72,36.97 73.52,37.17 73.52,40.42 76.36,43.27 76.36,47.13 76.56,47.33 76.56,48.15 73.92,50.79 73.92,60.13 73.31,60.74 73.31,80.05 72.3,81.06 72.3,84.92 v71.48,85.74
  Bottom 0.254: v36.74,52.21 30.03,52.21 U2.3 | v38.16,57.09 v36.94,55.87 | v38.16,64 38.16,68.06 v37.35,68.87 | v38.36,93.05 38.56,92.85 54.21,92.85 v55.02,92.04 | v73.72,36.97 69.86,36.97 U4.28 | v71.48,85.74 70.87,85.74 70.47,85.33 63.15,85.33 62.54,84.72 57.26,84.72 v57.06,84.52
A14  (via drill 0.51)
  Top 0.254: v58.28,93.46 58.28,91.02 58.68,90.61 58.68,88.79 U7.10 | v39.17,93.87 37.96,93.87 37.55,93.46 37.55,92.65 37.75,92.44 37.75,70.5 36.53,69.28 v36.53,68.06 | v38.97,63.18 38.77,62.98 38.77,57.7 39.58,56.88 v39.58,55.66 | v39.78,46.32 v39.78,53.02
  Bottom 0.254: 39.78,46.11 46.69,46.11 48.72,44.08 50.55,44.08 51.37,43.27 52.79,43.27 54.01,42.05 54.41,42.05 U4.3 | 39.78,46.11 34.09,46.11 30.84,49.36 30.23,49.36 30.03,49.57 U2.4 | v58.28,93.46 39.58,93.46 v39.17,93.87 | v36.53,68.06 37.55,67.04 37.55,64.61 37.35,64.4 37.35,63.59 37.75,63.18 v38.97,63.18 | v39.58,55.66 40.8,55.66 41.21,55.26 41.21,54.45 v39.78,53.02 | 39.78,46.11 v39.78,46.32
A15  (via drill 0.51)
  Top 0.254: v40.8,44.69 42.63,46.52 42.63,47.74 43.24,48.35 43.44,48.35 43.64,48.15 45.68,48.15 46.9,49.36 46.9,50.58 v46.69,50.79 | v66.2,83.91 66.2,86.55 66.4,86.75 66.4,88.58 U7.13 | v62.54,80.25 62.54,75.17 62.34,74.97 62.34,68.26 61.93,67.86 61.93,65.01 61.73,64.81 61.73,54.04 61.93,53.84 v61.93,45.71
  Bottom 0.254: v40.8,44.69 40.6,44.89 36.94,44.89 36.53,44.49 35.72,44.49 34.7,45.5 33.89,45.5 32.27,47.13 30.03,47.13 U2.5 | v46.69,50.79 48.12,50.79 50.35,48.55 50.35,46.72 49.94,46.32 49.94,45.3 50.35,44.89 51.77,44.89 52.99,46.11 56.24,46.11 56.65,45.71 v61.93,45.71 68.03,45.71 69.04,44.69 69.65,44.69 U4.31 | v62.54,80.25 v66.2,83.91
CLK  (via drill 0.51)
  Top 0.254: 28,45.71 28.81,44.89 29.83,44.89 29.83,44.69 U2.6 | 28,45.71 27.39,46.32 27.39,80.66 28.81,82.08 28.81,82.28 29.83,82.28 U3.4 29.83,82.49 29.83,84.92 U3.3 | v22.11,39 22.11,43.07 v23.53,44.49 | 28,45.71 v27.8,45.5
  Bottom 0.254: v22.11,39 17.84,34.73 16.82,34.73 U5.4 | v23.53,44.49 26.78,44.49 v27.8,45.5
D0  (via drill 0.51)
  Top 0.254: 52.18,57.09 53.6,58.51 53.6,58.71 54.41,58.71 U6.11 | 52.18,18.48 52.18,22.95 | 52.18,22.95 52.18,57.09 | 52.18,18.48 53.6,17.06 54.62,17.06 54.62,16.85 U4.13 | 52.18,22.95 v51.98,22.95 | v51.77,86.14 51.57,85.94 51.57,62.57 51.77,62.37 51.77,61.35 52.18,60.95 52.18,57.09 | 52.18,18.48 51.37,17.67 51.37,14.82 51.57,14.62 51.57,8.32 50.55,7.3 50.55,2.83 JP4.1
  Bottom 0.254: v51.98,22.95 46.9,22.95 46.69,22.75 43.04,22.75 42.63,22.34 33.08,22.34 32.06,23.35 31.86,23.35 30.84,24.37 30.03,24.37 U2.14 | U3.22 47.3,84.92 48.52,86.14 v51.77,86.14
D1  (via drill 0.51)
  Top 0.254: v48.32,55.87 48.12,55.66 48.12,19.49 v48.32,19.29 | v49.33,77.41 49.13,77.2 49.13,64 49.54,63.59 v49.54,58.1 | v52.18,15.23 52.18,8.32 52.99,7.51 52.99,2.83 JP4.2
  Bottom 0.254: 48.12,19.29 v52.18,15.23 52.79,15.23 53.8,14.21 54.41,14.21 U4.14 | 48.12,19.29 46.69,20.71 43.04,20.71 42.63,21.12 32.67,21.12 32.06,21.73 30.03,21.73 U2.15 | v48.32,55.87 49.54,55.87 | 49.54,55.87 52.38,55.87 52.79,56.27 54.41,56.27 U6.12 | 48.12,19.29 v48.32,19.29 | v49.33,77.41 49.33,79.03 48.32,80.05 48.12,80.05 46.08,82.08 45.47,82.08 45.27,82.28 U3.21 | 49.54,55.87 v49.54,58.1
D2  (via drill 0.51)
  Top 0.254: 52.79,33.11 52.79,18.88 54.01,17.67 56.04,17.67 56.24,17.87 56.45,17.87 57.06,17.26 57.06,13.4 | 52.79,33.11 52.79,52.62 53.6,53.43 53.6,53.63 54.41,53.63 U6.13 | 57.06,13.4 55.63,11.98 54.62,11.98 54.62,11.77 U4.15 | 52.79,33.11 v52.99,33.11 | v47.91,79.23 47.91,58.51 v51.37,55.05 | 57.06,13.4 57.06,8.32 55.63,6.9 55.63,2.83 JP4.3
  Bottom 0.254: v52.99,33.11 46.9,33.11 46.69,32.91 34.09,32.91 30.64,29.45 30.03,29.45 U2.12 | U3.20 47.3,79.84 v47.91,79.23 | v51.37,55.05 52.79,55.05 54.01,53.84 54.41,53.84 U6.13
D3  (via drill 0.51)
  Top 0.254: v34.5,41.03 34.5,42.66 34.09,43.07 34.09,62.78 41.61,70.3 42.43,70.3 42.83,70.7 v42.83,71.92 | v42.63,74.16 42.63,75.58 44.05,77 45.07,77 45.07,77.2 U3.19 | v70.06,0.8 70.06,3.44 69.86,3.64 69.86,8.93 U4.17 69.86,9.13 69.86,9.33 70.87,9.33 72.3,10.76 72.3,12.59 72.91,13.19 72.91,40.63 75.75,43.47 v75.75,47.74 | v61.73,75.58 61.73,68.47 61.32,68.06 61.32,65.22 61.12,65.01 v61.12,53.43
  Bottom 0.254: v34.5,41.03 32.06,41.03 30.64,39.61 30.03,39.61 U2.8 | v42.83,71.92 42.63,72.12 v42.63,74.16 | v70.06,0.8 69.65,0.39 60.51,0.39 58.48,2.43 58.48,2.63 58.28,2.63 JP4.4 | v75.75,47.74 74.73,48.75 73.11,48.75 70.67,51.19 69.86,51.19 U6.15 69.65,51.19 69.25,51.19 67.01,53.43 63.36,53.43 63.15,53.23 61.32,53.23 v61.12,53.43 | v61.73,75.58 61.53,75.38 58.88,75.38 56.04,78.22 53.2,78.22 51.57,76.59 46.9,76.59 46.08,77.41 45.27,77.41 U3.19
D4  (via drill 0.51)
  Top 0.254: v33.08,42.05 32.88,42.25 32.88,63.18 44.05,74.36 45.07,74.36 45.07,74.77 U3.18 | U6.16 69.65,53.63 68.84,53.63 68.84,53.43 68.03,52.62 68.03,18.88 69.25,17.67 71.28,17.67 71.48,17.87 71.69,17.87 72.3,17.26 72.3,13.4 70.87,11.98 69.86,11.98 69.86,11.77 U4.18 | v64.37,74.77 64.37,68.26 63.76,67.65 63.76,57.29 63.36,56.88 63.36,55.26 v63.15,55.05
  Bottom 0.254: v33.08,42.05 30.03,42.05 U2.7 | JP4.5 60.71,2.83 60.71,3.24 60.92,3.24 69.25,11.57 69.65,11.57 U4.18 | U3.18 47.3,74.77 47.91,75.38 52.79,75.38 52.99,75.17 55.63,75.17 55.84,74.97 56.65,74.97 56.85,74.77 v64.37,74.77 | v63.15,55.05 68.03,55.05 69.25,53.84 69.65,53.84 U6.16
D5  (via drill 0.51)
  Top 0.254: v33.08,36.97 32.88,37.17 32.88,40.63 33.89,41.64 33.89,42.46 33.48,42.86 33.48,62.98 41.61,71.11 v42.02,71.11 | v64.37,9.33 64.37,4.05 63.36,3.03 63.15,3.03 63.15,2.83 JP4.6 | v66,55.87 66.2,55.66 66.2,25.59 65.18,24.57 65.18,10.55 v64.98,10.35 | v57.67,68.87 57.67,57.09 v57.87,56.88
  Bottom 0.254: v33.08,36.97 30.03,36.97 U2.9 | v42.02,71.11 43.24,71.11 44.46,72.33 45.07,72.33 U3.17 45.27,72.12 45.47,71.92 46.08,71.92 47.71,70.3 52.79,70.3 52.99,70.09 55.63,70.09 55.84,69.89 56.65,69.89 v57.67,68.87 | v64.37,9.33 65.18,10.15 | 65.18,10.15 68.84,13.8 69.45,13.8 69.65,14.01 U4.19 | 65.18,10.15 v64.98,10.35 | U6.17 69.65,56.27 68.03,56.27 67.62,55.87 v66,55.87 64.78,57.09 58.07,57.09 v57.87,56.88
D6  (via drill 0.51)
  Top 0.254: v33.89,36.16 33.89,39.2 35.31,40.63 35.31,41.44 35.11,41.64 35.11,42.86 34.7,43.27 34.7,62.57 40.6,68.47 v41,68.47 | 67.42,57.09 68.84,58.51 68.84,58.71 69.65,58.71 U6.18 | 67.42,18.48 67.42,57.09 | 67.42,18.48 68.84,17.06 69.86,17.06 69.86,16.85 U4.20 | 67.42,18.48 65.79,16.85 65.79,2.83 JP4.7 | v67.01,63.39 67.01,61.35 67.42,60.95 67.42,57.09
  Bottom 0.254: v33.89,36.16 32.27,36.16 30.64,34.53 30.03,34.53 U2.10 | v41,68.47 43.24,68.47 44.46,69.69 U3.16 50.96,69.69 52.59,68.06 56.04,68.06 60.92,63.18 66.81,63.18 v67.01,63.39
D7  (via drill 0.51)
  Top 0.254: v33.08,26.81 32.88,27.01 32.88,33.92 35.92,36.97 35.92,41.64 35.72,41.85 35.72,43.07 35.31,43.47 35.31,62.37 38.97,66.03 v39.38,66.03 | U6.19 69.86,61.35 70.87,61.35 70.87,61.15 72.3,59.73 72.3,20.92 70.87,19.49 69.86,19.49 69.86,19.29 U4.21 | v67.42,17.26 67.42,8.32 68.23,7.51 68.23,2.83 JP4.8
  Bottom 0.254: v33.08,26.81 30.03,26.81 U2.13 | v39.38,66.03 43.24,66.03 44.46,67.25 45.07,67.25 U3.15 45.27,67.04 45.47,66.84 46.08,66.84 48.93,64 51.57,64 52.59,62.98 56.04,62.98 56.45,62.57 68.03,62.57 69.25,61.35 69.65,61.35 U6.19 | v67.42,17.26 68.03,17.87 68.03,18.07 69.25,19.29 69.65,19.29 U4.21
GND
  pour Bottom (hatched): -0.32,100.48 80.96,100.48 80.96,-0.48 -0.32,-0.48
  pour Top: -0.32,100.48 80.96,100.48 80.96,-0.48 -0.32,-0.48
N$1  (via drill 0.51)
  Top 0.254: U5.6 16.82,30.06 15.81,30.06 14.38,31.48 v14.38,34.73 14.38,35.55 15.81,36.97 15.81,37.17 16.82,37.17 U5.3 | R2.2 9.3,42.25 9.3,38.39 12.56,35.14 12.56,34.94 R1.2
  Bottom 0.254: v14.38,34.73 12.56,34.73 R1.2
N$2  (via drill 0.51)
  Top 0.254: v19.26,57.29 v19.26,41.24 | v41.21,58.91 41.41,59.12 41.41,63.18 v41.21,63.39
  Bottom 0.254: v19.26,41.24 17.84,39.81 16.82,39.81 U5.2 | v19.26,57.29 20.68,58.71 28.2,58.71 28.4,58.91 35.52,58.91 35.72,58.71 36.53,58.71 36.94,59.12 41,59.12 v41.21,58.91 | v41.21,63.39 43.24,63.39 44.46,64.61 U3.14
N$3  (via drill 0.51)
  Top 0.254: Q1.1 16.42,15.63 16.42,16.24 16.01,16.65 16.01,16.85 15.4,17.46 15.4,20.31 15.2,20.51 15.2,20.92 C12.1 15.2,21.12 15.2,21.73 14.38,22.54 v14.38,30.26 14.38,30.67 13.77,31.28 13.77,33.31 13.37,33.72 13.37,41.24 12.76,41.85 12.76,42.05 12.56,42.25 R1.1
  Bottom 0.254: v14.38,30.26 14.38,30.47 16.21,32.3 16.82,32.3 U5.5
N$4
  Bottom 0.254: U7.12 63.76,88.58 63.76,87.77 63.56,87.77 62.14,86.35 55.43,86.35 54.01,87.77 54.01,88.79 53.8,88.79 U7.8
N$5
  Top 0.254: 15.2,8.93 15.2,5.27 C13.1 | 15.2,8.93 16.42,10.15 16.42,10.76 Q1.2 | 15.2,8.93 14.79,9.33 14.79,18.88 13.57,20.1 13.57,21.73 13.77,21.93 13.77,29.65 9.3,34.12 9.3,34.73 R2.1
N$6
  Top 0.254: VCCRG.2 15.6,72.73 15.6,67.25 REG.3
N$7
  Top 0.254: R6.2 13.77,55.87 11.95,55.87 11.34,55.26 11.13,55.26 11.13,55.66 LED2.A
N$8
  Top 0.254: R7.2 13.77,50.99 13.37,50.99 12.56,51.8 11.34,50.58 11.13,50.58 11.13,50.79 LED3.A
N$12  (via drill 0.51)
  Top 0.66: v14.59,79.44 14.59,85.94 13.98,86.55 13.98,87.77 U$2.1
  Bottom 0.66: v14.59,79.44 7.88,79.44 5.85,77.41 5.24,77.41 D3.A
N$14  (via drill 0.51)
  Top 0.254: R9.1 8.08,14.01 7.68,14.01 6.87,13.19 6.46,13.19 5.24,14.41 5.04,14.41 5.04,14.21 R10.1 | v2.6,14.41 2.8,14.62 2.8,19.7 3,19.9 3,23.96 2.8,24.17 2.8,25.59 RESET.2
  Bottom 0.254: v2.6,14.41 4.22,14.41 4.43,14.21 5.04,14.21 R10.1
N$17
  Top 0.254: R15.2 13.77,60.34 11.95,60.34 11.34,60.95 11.13,60.95 11.13,60.54 LED1.A
PRXI  (via drill 0.51)
  Top 0.254: v27.39,86.96 27.39,90.61 29.01,92.24 33.89,92.24 38.56,96.91 38.77,96.91 38.77,97.12 JP1.4
  Bottom 0.254: v27.39,86.96 27.39,86.55 24.95,84.11 21.09,84.11 19.06,82.08 19.06,81.88 R4.2
PTXO  (via drill 0.51)
  Top 0.254: v25.36,93.66 25.36,81.88 R3.2 | v31.66,93.66 32.88,93.66 v33.48,93.05
  Bottom 0.254: v25.36,93.66 25.56,93.46 31.45,93.46 v31.66,93.66 | v33.48,93.05 33.69,92.85 36.94,92.85 41.21,97.12 JP1.5
RXI  (via drill 0.51)
  Top 0.254: v19.26,69.69 19.87,69.08 19.87,57.9 21.5,56.27 21.5,55.87 R6.1 | v19.26,72.53 19.26,73.34 19.06,73.55 19.06,73.95 R4.1 19.06,74.16 19.06,74.36 20.68,75.98 v20.68,82.49
  Bottom 0.254: v19.26,72.53 v19.26,69.69 | v20.68,82.49 21.7,83.5 25.15,83.5 29.22,87.57 29.83,87.57 U3.2
TXO  (via drill 0.51)
  Top 0.254: v24.75,50.99 24.54,51.19 24.54,61.96 23.93,62.57 23.93,71.92 25.36,73.34 25.36,73.55 25.56,73.75 25.56,73.95 R3.1
  Bottom 0.254: v24.75,50.99 21.7,50.99 R7.1 | U3.6 29.83,77.41 29.22,77.41 25.76,73.95 25.56,73.95 R3.1
USBVCC
  Bottom 0.66: JP2.2 24.14,97.12 24.75,97.12 26.58,95.29 34.5,95.29 36.33,97.12 JP1.3
VCC  (via drill 0.51)
  Top 0.66: C11.1 73.92,84.31 73.92,87.57 73.31,88.18 73.31,88.38 73.11,88.58 73.11,88.99 C9.1 | C8.1 73.92,47.33 73.92,47.74 73.52,48.15 73.52,48.75 73.11,49.16 73.11,59.93 72.5,60.54 72.5,79.84 70.67,81.67 70.06,81.67 U6.27 69.86,81.88 69.86,84.11 U6.28 69.86,84.52 v69.86,86.14 70.87,87.16 70.87,88.18 v71.28,88.58 | U2.24 45.07,16.85 45.07,19.09 U2.25 | 32.27,15.02 30.84,16.45 29.83,16.45 29.83,16.65 U2.17 | 32.27,15.02 32.47,14.82 32.47,8.32 30.23,6.08 30.23,2.83 JP5.1 | v32.47,15.43 32.47,15.23 32.27,15.02 | R15.1 21.5,60.54 21.5,60.95 21.29,61.15 21.29,61.35 20.68,61.96 20.68,69.69 15.6,74.77 15.6,75.38 VCCRG.1 15.6,75.58 15.6,81.47 21.5,87.36 21.5,92.04 | 21.5,92.04 21.5,97.12 JP2.1 | v23.73,61.56 23.73,47.94 24.14,47.54 24.14,46.32 C10.1 24.54,46.11 24.54,42.66 U5.14 24.34,42.25 24.54,42.05 24.75,42.25 25.56,42.25 26.98,40.83 v26.98,33.92 27.19,33.72 27.19,18.88 27.39,18.68 v27.39,16.85 | v46.49,92.04 49.13,89.39 49.13,84.11 JP3.1 | v21.7,92.04 21.5,92.04
  Bottom 0.66: 71.28,88.79 72.3,88.79 72.5,88.99 72.91,88.99 C9.1 | 71.28,88.79 69.04,88.79 U7.14 | U4.32 69.86,47.13 73.92,47.13 C8.1 | v69.86,86.14 62.95,86.14 62.34,85.53 55.23,85.53 54.62,86.14 53.2,86.14 50.96,83.91 49.33,83.91 JP3.1 | v71.28,88.58 71.28,88.79 | R9.2 8.29,21.73 8.69,21.73 9.1,21.32 9.3,21.32 12.56,18.07 24.75,18.07 25.97,16.85 25.97,16.65 25.76,16.65 C5.1 26.17,16.65 27.39,16.65 | 27.39,16.65 29.83,16.65 U2.17 | v32.47,15.43 43.04,15.43 44.25,16.65 45.07,16.65 U2.24 | v26.98,33.92 29.01,31.89 29.83,31.89 U2.11 | 23.73,61.76 25.15,61.76 25.36,61.96 25.56,61.96 C1.1 25.97,62.17 29.83,62.17 U3.12 | 23.73,61.76 23.32,61.76 22.11,60.54 21.7,60.54 R15.1 | v23.73,61.56 23.73,61.76 | v27.39,16.85 27.39,16.65 | v21.7,92.04 v46.49,92.04
VPP
  Bottom 0.66: U6.1 54.41,84.31 53.8,84.31 51.98,82.49 50.96,82.49 50.15,81.67 49.94,81.67 49.74,81.47 49.33,81.47 JP3.2

### Text on the board
Top: Mini Z80 Board 1.3
tNames: VCCEN | GND | RTS | VCC | RXI | TXO | N/A | Mini Z80 Board 1.3 | VCC | GND | A0 | A1 | !WR | !M1 | A7 | !IORQ | D0 | D7